# Altium schematic sheet Khoi_trung_Tam.SchDoc
size A4; SheetNumber: 2; SheetTotal: 6
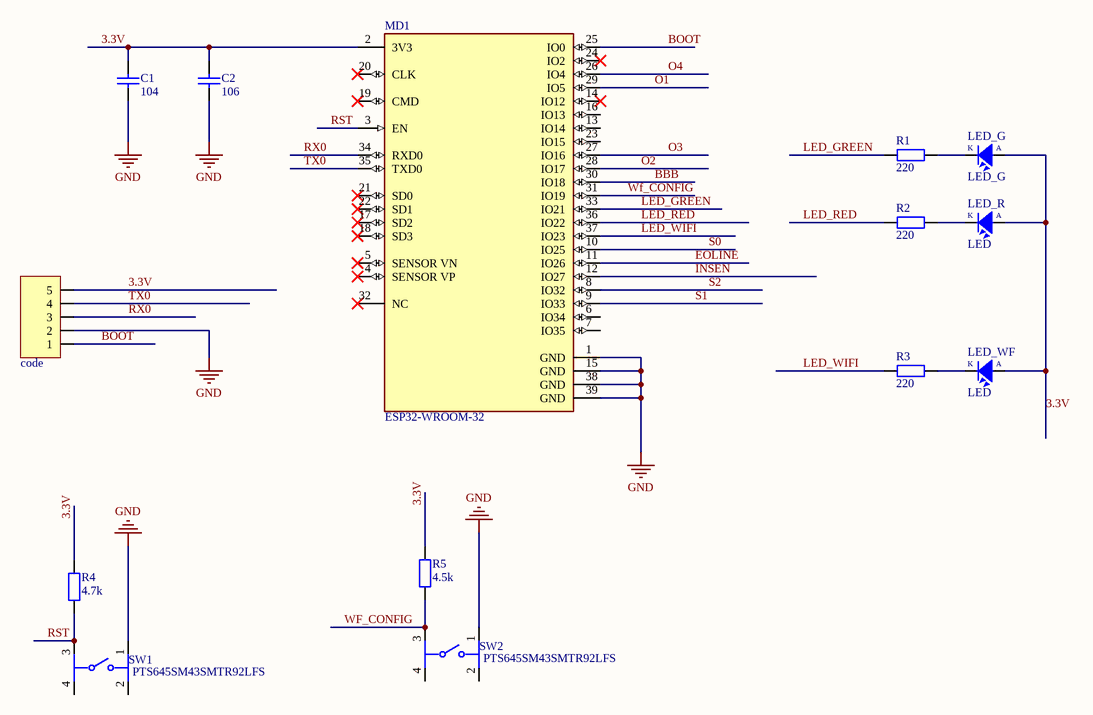
[diagram p0: Khoi_trung_Tam.SchDoc]

## Parts
C1  104  [tu 0603]
C2  106  [tu 0603]
JP1  code  [JP 1x5 CT]
LED_G  LED_G  [LED-0805]
LED_R  LED  [LED-0805]
LED_WF  LED  [LED-0805]
MD1  ESP32-WROOM-32  [FP-ESP32-WROOM-32-MFG]
R1  220  [tro smd 0805]
R2  220  [tro smd 0805]
R3  220  [tro smd 0805]
R4  4.7k  [tro smd 0805]
R5  4.5k  [tro smd 0805]
SW1  PTS645SM43SMTR92LFS  [FP-PTS645SM43SMTR92LFS-MFG]
SW2  PTS645SM43SMTR92LFS  [FP-PTS645SM43SMTR92LFS-MFG]

## Nets
GND: C1.2 C2.2 JP1.2 MD1.1(GND) MD1.15(GND) MD1.38(GND) MD1.39(GND) SW1.1 SW2.1
3.3V: C1.1 C2.1 JP1.5 LED_G.1(A) LED_R.1(A) LED_WF.1(A) MD1.2(3V3) R4.2 R5.2
BBB: MD1.30(IO18)
BOOT: JP1.1 MD1.25(IO0)
EOLINE: MD1.11(IO26)
INSEN: MD1.12(IO27)
LED_GREEN: MD1.33(IO21) R1.1
LED_RED: MD1.36(IO22) R2.1
LED_WIFI: MD1.37(IO23) R3.1
O1: MD1.29(IO5)
O2: MD1.28(IO17)
O3: MD1.27(IO16)
O4: MD1.26(IO4)
RST: MD1.3(EN) R4.1 SW1.3
RX0: JP1.3 MD1.34(RXD0)
S0: MD1.10(IO25)
S1: MD1.9(IO33)
S2: MD1.8(IO32)
TX0: JP1.4 MD1.35(TXD0)
WF_CONFIG: MD1.31(IO19) R5.1 SW2.3
NetLED_G_2: LED_G.2(K) R1.2
NetLED_R_2: LED_R.2(K) R2.2
NetLED_WF_2: LED_WF.2(K) R3.2

Not connected (* = marked no-connect by the designer): MD1 4(SENSOR_VP)* 5(SENSOR_VN)* 6(IO34) 7(IO35) 13(IO14) 14(IO12)* 16(IO13) 17(SD2)* 18(SD3)* 19(CMD)* 20(CLK)* 21(SD0)* 22(SD1)* 23(IO15) 24(IO2)* 32(NC)*; SW1 2 4; SW2 2 4

## Library data of the parts
C1 = Tu 0603 104 50V 10%: Dán; Don_Vi: Con; So_Chan: 2; Ten_Linh_Kien: Tụ 0603 104-100nF 10% 50V; Ma_Hang: MH004568; Chung_Loai: Dán; Kieu_Chan: *
C2 = Tu 0603 106 16V 20%: Dán; Don_Vi: Con; So_Chan: 2; Ten_Linh_Kien: Tụ 0603-10uF 20% 16V; Ma_Hang: MH004848; Chung_Loai: Dán; Kieu_Chan: *
JP1 = JP 1x5 2.54 Cai Thang: Cắm; Ten_Linh_Kien: Jump Đơn Cái 2.54MM 1x20P Thẳng; Don_Vi: Con; Ma_Hang: MH004006; Ghi_Chu: *; Kieu_Chan: *; Chung_Loai: Cắm
LED_G LED_R LED_WF = LED: LED Single colour Green and Red; Value: LED 3 ly Single Colour
MD1 = CMP-194065-000008-1: RX TXRX MOD WIFI SURFACE MOUNT; Frequency: 2.5GHz; Sensitivity: -98dBm; Operating Supply Voltage: 3.6V; Data Rate: 150Mbps; Weight: 0.088185oz; Package Quantity: 550; Min Operating Temperature: -40°C; Mount: Surface Mount; Max Operating Temperature: 85°C; Packaging: Cut Tape; Case/Package: SMD/SMT
R1-R5 = Tro 0805 1% 1R: Dán; Don_Vi: Con; So_Chan: 2; Ten_Linh_Kien: Trở 0805 1% 1R; Ma_Hang: MH004177; Chung_Loai: Dán; Kieu_Chan: *
SW1 SW2 = CMP-2000-05160-2: SWITCH TACTILE SPST-NO 0.05A 12V; Contact Resistance: 100mR; Throw Configuration: SPST; Illumination Type: Non-Illuminated; Mechanical Life: 100000Cycles; Current Rating: 50mA; Switch Function: Off-Mom; Actuator Length: 0.85mm; Actuator Material: Nylon; Actuator Type: Standard; Operating Force: 160gf; Min Operating Temperature: -20°C; REACH SVHC: No SVHC; Termination: Gull Wing; Case/Package: SMD/SMT; Packaging: Tape and Reel; Mount: Surface Mount; Voltage Rating (DC): 12V; Orientation: Straight; Lead Free: Lead Free; Contact Material: Silver; Color: Black; Max Current Rating: 50mA; Contact Plating: Silver; Depth: 9mm; Package Quantity: 1; Max Voltage Rating (DC): 12V; Length: 6mm; Max Operating Temperature: 60°C